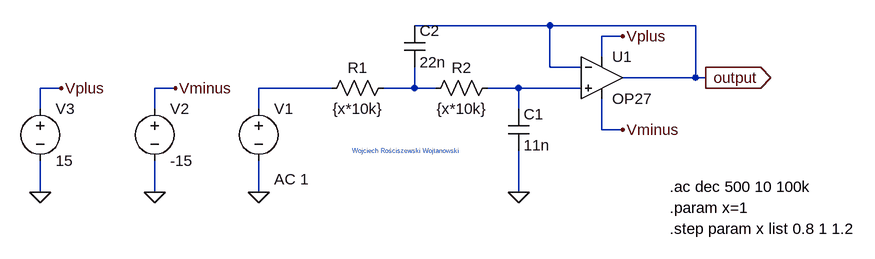
[diagram p0: schematic Analysis of the low-pass filter system modifier R1 and R2.asc]
Analysis of the low-pass filter system modifier R1 and R2.asc, the LTspice schematic file:
Version 4
SHEET 1 1120 680
WIRE 624 -144 416 -144
WIRE 848 -144 624 -144
WIRE 736 -128 704 -128
WIRE 704 -96 704 -128
WIRE 624 -80 624 -144
WIRE 672 -80 624 -80
WIRE 848 -64 848 -144
WIRE 848 -64 736 -64
WIRE 864 -64 848 -64
WIRE -128 -48 -160 -48
WIRE 48 -48 16 -48
WIRE 288 -48 176 -48
WIRE 416 -48 416 -80
WIRE 416 -48 368 -48
WIRE 448 -48 416 -48
WIRE 576 -48 528 -48
WIRE 672 -48 576 -48
WIRE -160 -16 -160 -48
WIRE 16 -16 16 -48
WIRE 176 -16 176 -48
WIRE 576 -16 576 -48
WIRE 704 16 704 -32
WIRE 736 16 704 16
WIRE -160 112 -160 64
WIRE 16 112 16 64
WIRE 176 112 176 64
WIRE 576 112 576 48
FLAG -160 112 0
FLAG 16 112 0
FLAG 176 112 0
FLAG 576 112 0
FLAG 864 -64 output
IOPIN 864 -64 Out
FLAG 736 16 Vminus
FLAG 736 -128 Vplus
FLAG 48 -48 Vminus
FLAG -128 -48 Vplus
SYMBOL voltage 176 -32 R0
WINDOW 123 24 124 Left 2
WINDOW 39 0 0 Left 0
SYMATTR Value2 AC 1
SYMATTR InstName V1
SYMATTR Value ""
SYMBOL voltage 16 -32 R0
WINDOW 123 0 0 Left 0
WINDOW 39 0 0 Left 0
SYMATTR InstName V2
SYMATTR Value -15
SYMBOL voltage -160 -32 R0
WINDOW 123 0 0 Left 0
WINDOW 39 0 0 Left 0
SYMATTR InstName V3
SYMATTR Value 15
SYMBOL res 384 -64 R90
WINDOW 0 0 56 VBottom 2
WINDOW 3 32 56 VTop 2
SYMATTR InstName R1
SYMATTR Value {x*10k}
SYMBOL res 544 -64 R90
WINDOW 0 0 56 VBottom 2
WINDOW 3 32 56 VTop 2
SYMATTR InstName R2
SYMATTR Value {x*10k}
SYMBOL cap 560 -16 R0
SYMATTR InstName C1
SYMATTR Value 11n
SYMBOL cap 400 -144 R0
SYMATTR InstName C2
SYMATTR Value 22n
SYMBOL Opamps\\OP27 704 -128 R0
SYMATTR InstName U1
TEXT 808 104 Left 2 !.ac dec 500 10 100k
TEXT 320 48 Left 0 ;Wojciech Rościszewski Wojtanowski
TEXT 808 136 Left 2 !.param x=1
TEXT 808 168 Left 2 !.step param x list 0.8 1 1.2

The netlist it stands for:
* Analysis of the low-pass filter system modifier R1 and R2.asc
V1 N001 0 AC 1
V2 Vminus 0 -15
V3 Vplus 0 15
R1 N002 N001 {x*10k}
R2 N003 N002 {x*10k}
C1 N003 0 11n
C2 output N002 22n
XU1 N003 output Vplus Vminus output OP27  ; pins In+ In- V+ V- OUT
.ac dec 500 10 100k
* Wojciech Rościszewski Wojtanowski
.param x=1
.step param x list 0.8 1 1.2
.lib ADI.lib
.backanno
.end